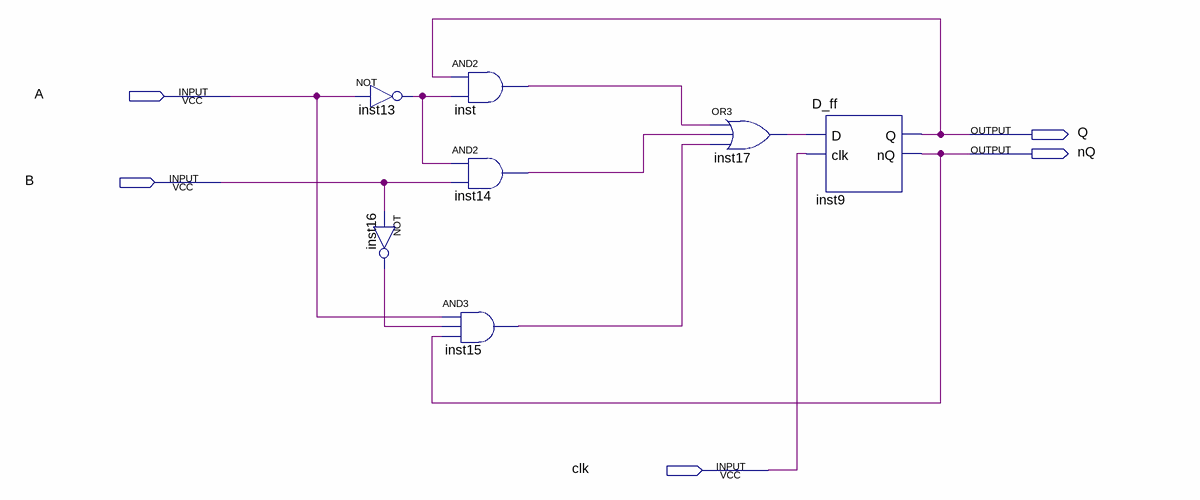
[diagram p0: schematic sheet]
// Quartus schematic AB_ff.bdf as structural Verilog: 7 symbols, 5 pins
module AB_ff (
  input  A,
  input  B,
  input  clk,
  output Q,
  output nQ
);

  wire inst13_out, inst14_out, inst15_out, inst16_out, inst17_out, inst_out;

  not inst13 (inst13_out, A);
  not inst16 (inst16_out, B);
  and inst (inst_out, Q, inst13_out);
  and inst14 (inst14_out, inst13_out, B);
  and inst15 (inst15_out, A, inst16_out, nQ);
  or inst17 (inst17_out, inst_out, inst14_out, inst15_out);
  D_ff inst9 (.D(inst17_out), .clk(clk), .Q(Q), .nQ(nQ));
endmodule
